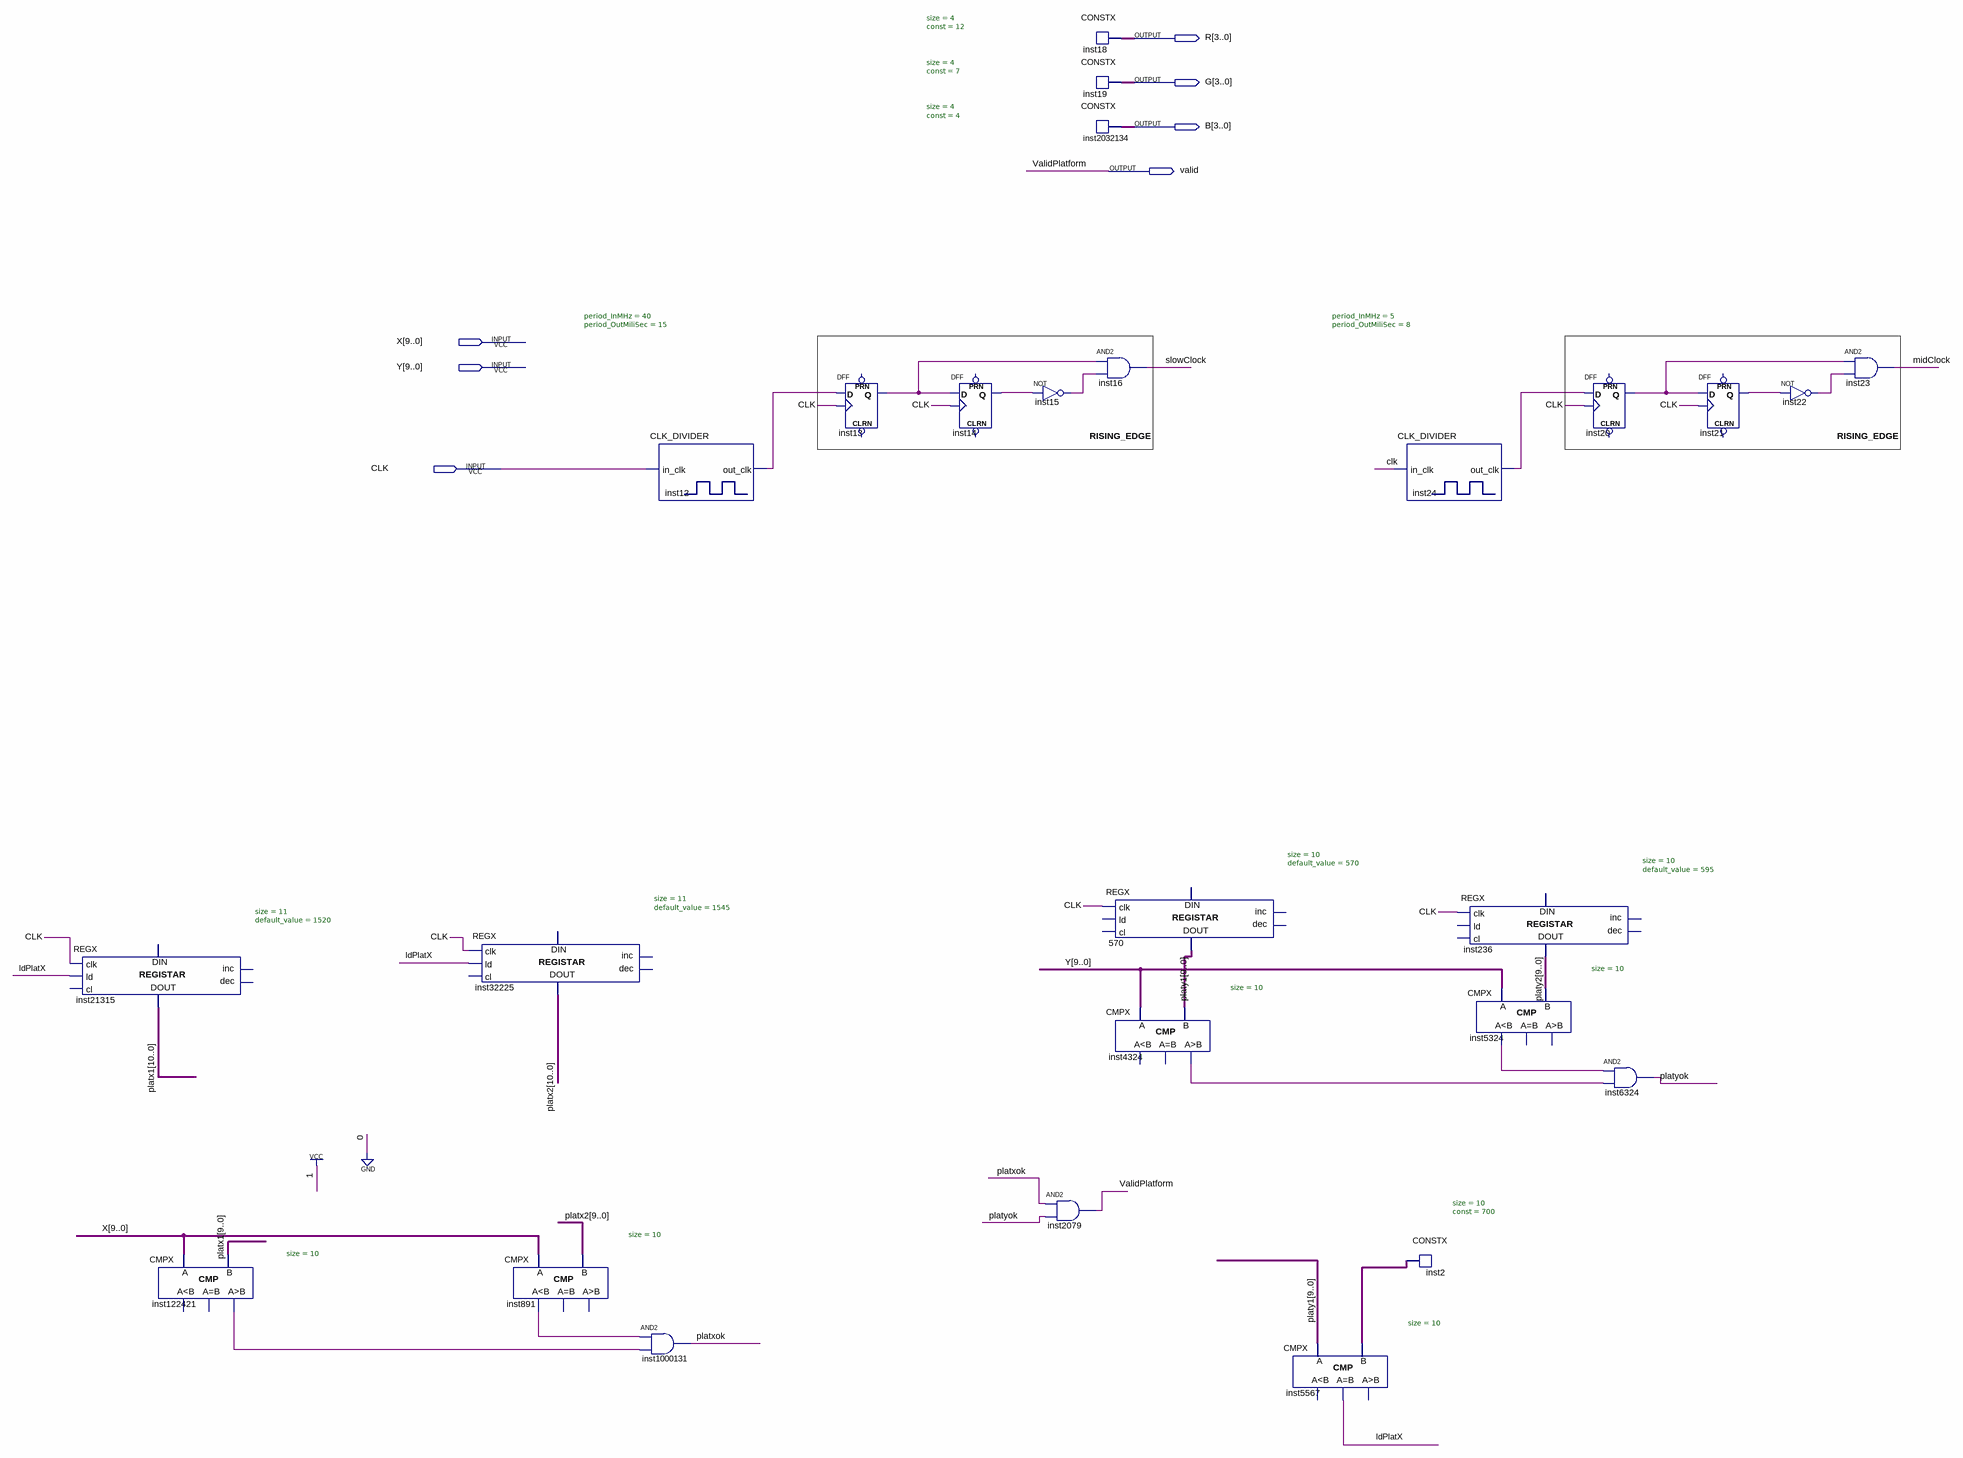
[diagram p0: schematic sheet]
// Quartus schematic ProjekatNovo.bdf as structural Verilog: 26 symbols, 7 pins
module ProjekatNovo (
  input  [9:0] X,
  input  [9:0] Y,
  input  CLK,
  output [3:0] R,
  output [3:0] G,
  output [3:0] B,
  output valid
);

  wire inst12_out_clk, inst13_q, inst14_q, inst15_out, inst20_q, inst21_q, inst22_out, inst24_out_clk,
       inst891_ls, inst4324_gr, inst5324_ls, inst122421_gr, ldPlatX, midClock, platxok, platyok, slowClock;
  wire [9:0] inst2_data, platy1, platy2;
  wire [10:0] platx1, platx2;

  REGX #(.size(11), .default_value(1520)) inst21315 (
    .clk(CLK), .ld(ldPlatX), .data_out(platx1));  // open: cl, inc, dec, data_in
  CMPX #(.size(10)) inst122421 (.A(X), .B(platx1[9:0]), .gr(inst122421_gr));  // open: ls, eq
  REGX #(.size(11), .default_value(1545)) inst32225 (
    .clk(CLK), .ld(ldPlatX), .data_out(platx2));  // open: cl, inc, dec, data_in
  CMPX #(.size(10)) inst891 (.A(X), .B(platx2[9:0]), .ls(inst891_ls));  // open: eq, gr
  CLK_DIVIDER #(.period_InMHz(40), .period_OutMiliSec(15)) inst12 (.in_clk(CLK), .out_clk(inst12_out_clk));
  and inst1000131 (platxok, inst891_ls, inst122421_gr);
  DFF inst13 (.CLK(CLK), .D(inst12_out_clk), .Q(inst13_q));  // open: CLRN, PRN
  DFF inst14 (.CLK(CLK), .D(inst13_q), .Q(inst14_q));  // open: CLRN, PRN
  not inst15 (inst15_out, inst14_q);
  and inst2079 (valid, platxok, platyok);
  CONSTX #(.size(4), .\const (12)) inst18 (.data(R));
  CONSTX #(.size(4), .\const (7)) inst19 (.data(G));
  CONSTX #(.size(4), .\const (4)) inst2032134 (.data(B));
  and inst16 (slowClock, inst13_q, inst15_out);
  REGX #(.size(10), .default_value(570)) u_570 (.clk(CLK), .data_out(platy1));  // open: ld, cl, inc, dec, data_in
  CMPX #(.size(10)) inst4324 (.A(Y), .B(platy1), .gr(inst4324_gr));  // open: ls, eq
  CMPX #(.size(10)) inst5567 (.A(platy1), .B(inst2_data), .eq(ldPlatX));  // open: ls, gr
  CLK_DIVIDER #(.period_InMHz(5), .period_OutMiliSec(8)) inst24 (.in_clk(CLK), .out_clk(inst24_out_clk));
  CONSTX #(.size(10), .\const (700)) inst2 (.data(inst2_data));
  REGX #(.size(10), .default_value(595)) inst236 (.clk(CLK), .data_out(platy2));  // open: ld, cl, inc, dec, data_in
  CMPX #(.size(10)) inst5324 (.A(Y), .B(platy2), .ls(inst5324_ls));  // open: eq, gr
  DFF inst20 (.CLK(CLK), .D(inst24_out_clk), .Q(inst20_q));  // open: CLRN, PRN
  and inst6324 (platyok, inst5324_ls, inst4324_gr);
  DFF inst21 (.CLK(CLK), .D(inst20_q), .Q(inst21_q));  // open: CLRN, PRN
  not inst22 (inst22_out, inst21_q);
  and inst23 (midClock, inst20_q, inst22_out);

  // Other names for the same wires on the sheet: ValidPlatform = valid

  // Notes on the sheet:
  //   RISING_EDGE
  //   RISING_EDGE
endmodule
